# EAGLE design ESP Nano (EAGLE 6.5.0)
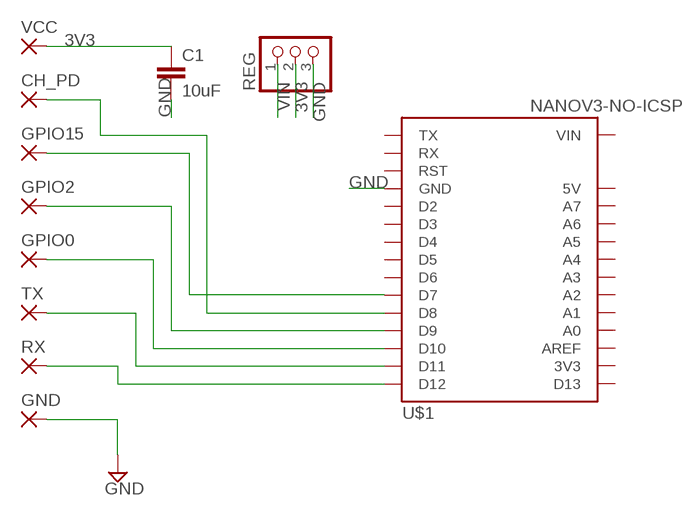
[diagram p0: schematic, sheet 1]

## Parts
C1  10uF  C2,5-3  [C2.5-3]
CH_PD  1,6/0,9  [1,6/0,9]
GND  1,6/0,9  [1,6/0,9]
GPIO0  1,6/0,9  [1,6/0,9]
GPIO2  1,6/0,9  [1,6/0,9]
GPIO15  1,6/0,9  [1,6/0,9]
REG  PINHD-1X3  [1X03]
RX  1,6/0,9  [1,6/0,9]
TX  1,6/0,9  [1,6/0,9]
U$1  NANOV3-NO-ICSP  [NANOV3-NO-ICSP]
VCC  1,6/0,9  [1,6/0,9]

## Nets
3V3: C1.1 REG.2 VCC.1(P)
GND: C1.2 GND.1(P) REG.3 U$1.GND@1(GND) U$1.GND@2(GND)
N$1: RX.1(P) U$1.D12
N$3: GPIO0.1(P) U$1.D10
N$4: GPIO2.1(P) U$1.D9
N$5: TX.1(P) U$1.D11
N$6: GPIO15.1(P) U$1.D7
N$10: CH_PD.1(P) U$1.D8
VIN: REG.1
Unconnected: U$1.3V3 U$1.5V U$1.A0 U$1.A1 U$1.A2 U$1.A3 U$1.A4 U$1.A5 U$1.A6 U$1.A7 U$1.AREF U$1.D2 U$1.D3 U$1.D4 U$1.D5 U$1.D6 U$1.D13 U$1.RST1(RST) U$1.RST2(RST) U$1.RX U$1.TX

## Power pins joined to a net without a drawn wire
VIN: U$1.VIN

## Library data of the parts
C1 = capacitor-wima:C: CAPACITOR naming: grid - package width
CH_PD GND GPIO0 GPIO2 GPIO15 RX TX VCC = wirepad:1,6/0,9: THROUGH-HOLE PAD
REG = pinhead:PINHD-1X3: PIN HEADER
U$1 = Franc:NANOV3-NO-ICSP: Nano V3 without the ICSP header

## Board
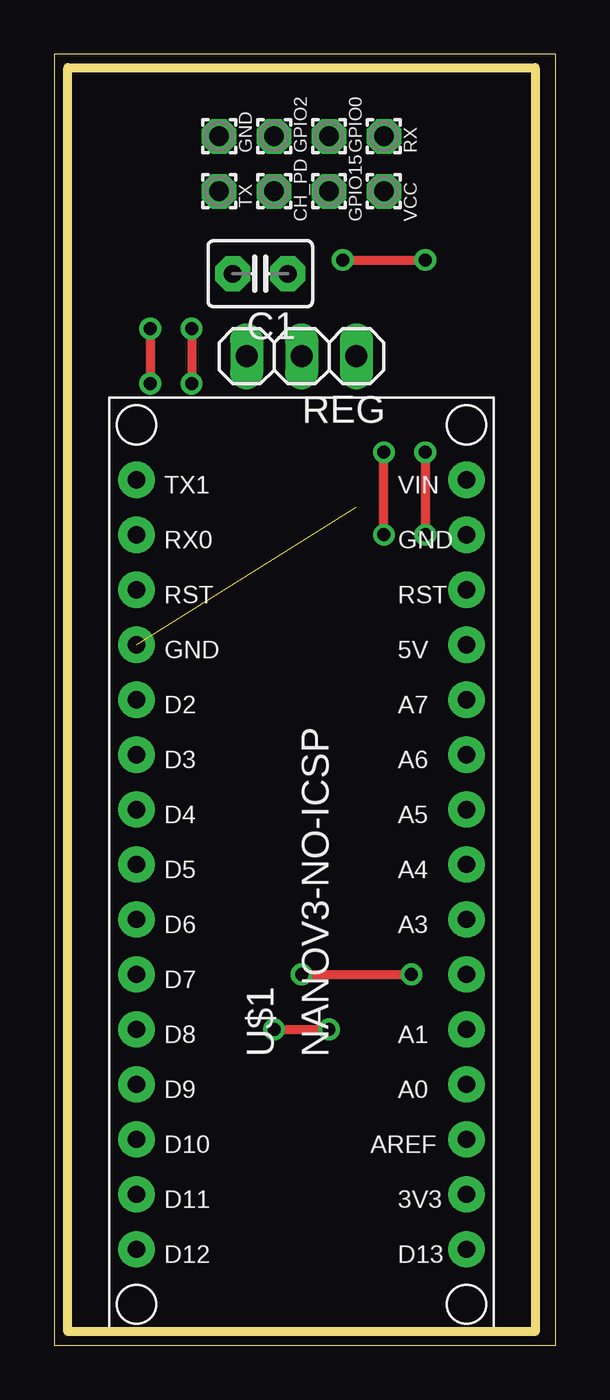
[diagram p1: board, top side]
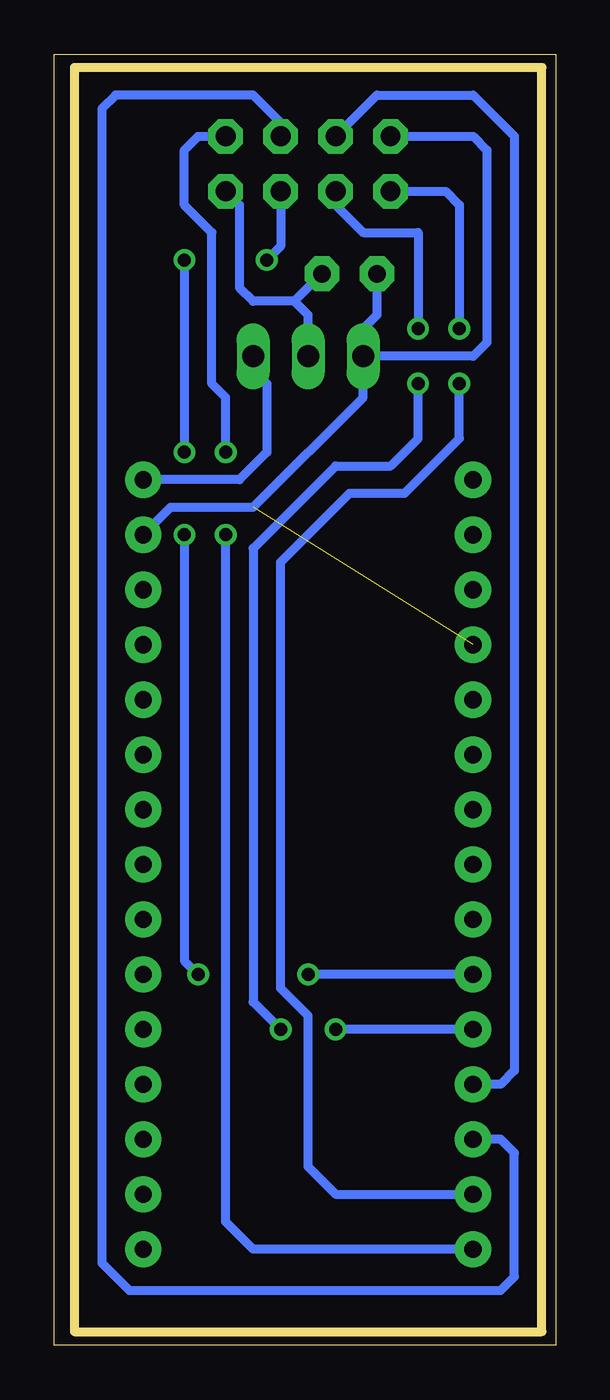
[diagram p2: board, bottom side, seen from below]

Size 23.16 x 59.68 mm. Coordinates in mm from the lower left corner, seen from the top.
Outline: 0,0 23.16,0 23.16,59.68 0,59.68 0,0
Copper layers (1*16): Top 0.035mm / dielectric 1.5mm / Bottom 0.035mm
Design rules "default": minimum track width 10mil, minimum drill 24mil, track to track 8mil, track to pad 8mil, pad to pad 8mil, via to via 8mil, smd to smd 8mil, copper to edge 40mil, drill to drill 8mil, minimum pad ring 10mil, minimum via ring 8mil, stop-mask expansion 4mil, vias tented up to drill 0mil, thermal gap 10mil
Milling: 4 lines

### Footprints (pad centres in the part's own frame; a part is rotated, then mirrored left to right if it is on the bottom)
C2.5-3 = drill 0.813 pad 1.6 octagon: 1 -1.27,0; 2 1.27,0
1,6/0,9 = drill 0.914 pad 1.6 octagon: 1 0,0
1X03 = drill 1.016 long: 1 -2.54,0; 2 0,0; 3 2.54,0
NANOV3-NO-ICSP = drill 0.8 pad 1.676: 3V3 3.81,-13.97; 5V 3.81,11.43; A0 3.81,-8.89; A1 3.81,-6.35; A2 3.81,-3.81; A3 3.81,-1.27; A4 3.81,1.27; A5 3.81,3.81; A6 3.81,6.35; A7 3.81,8.89; AREF 3.81,-11.43; D2 -11.43,8.89; D3 -11.43,6.35; D4 -11.43,3.81; D5 -11.43,1.27; D6 -11.43,-1.27; D7 -11.43,-3.81; D8 -11.43,-6.35; D9 -11.43,-8.89; D10 -11.43,-11.43; D11 -11.43,-13.97; D12 -11.43,-16.51; D13 3.81,-16.51; GND@1 -11.43,11.43; GND@2 3.81,16.51; RST1 -11.43,13.97; RST2 3.81,13.97; RX -11.43,16.51; TX -11.43,19.05; VIN 3.81,19.05

### Placement (x,y rotation side)
C1  9.53,49.53 180 top
CH_PD  10.16,53.34 90 top
GND  7.62,55.88 90 top
GPIO0  12.7,55.88 90 top
GPIO2  10.16,55.88 90 top
GPIO15  12.7,53.34 90 top
REG  11.43,45.72 180 top
RX  15.24,55.88 90 top
TX  7.62,53.34 90 top
U$1  15.24,20.95 0 top
VCC  15.24,53.34 90 top

### Tracks (layer width: path | path; a pad name or v marks a point on that pad's centre or on a via)
3V3
  Bottom 0.406: REG.2 11.43,47.62 12.06,48.26 | 12.06,48.26 13.97,48.26 14.61,48.9 14.61,52.7 VCC.1 | C1.1 12.06,48.26
GND  (1 unrouted)
  Bottom 0.406: REG.3 3.81,45.72 3.17,46.35 3.17,55.24 3.81,55.88 GND.1 | REG.3 8.89,43.81 13.97,38.73 17.78,38.73 U$1.GND@2 | C1.2 8.26,47.62 8.89,46.99 REG.3
N$1  (via drill 0.6)
  Top 0.406: v15.24,37.47 v15.24,41.27
  Bottom 0.406: U$1.D12 13.97,4.45 15.24,5.71 v15.24,37.47 | RX.1 16.51,55.88 17.14,55.24 17.14,52.7 15.88,51.44 15.88,44.45 15.24,43.81 v15.24,41.27
N$3
  Bottom 0.406: GPIO0.1 12.7,56.52 13.97,57.78 20.32,57.78 20.95,57.15 20.95,3.81 19.68,2.54 2.54,2.54 1.91,3.17 1.91,8.89 2.54,9.53 U$1.D10
N$4
  Bottom 0.406: GPIO2.1 8.26,57.78 3.81,57.78 1.91,55.88 1.91,12.7 2.54,12.06 U$1.D9
N$5  (via drill 0.6)
  Top 0.406: v4.45,46.99 v4.45,44.45
  Bottom 0.406: v4.45,44.45 4.45,41.91 6.99,39.37 9.53,39.37 12.7,36.2 12.7,16.51 11.43,15.24 11.43,8.26 10.16,6.99 U$1.D11 | TX.1 5.08,53.34 4.45,52.7 v4.45,46.99
N$6  (via drill 0.6)
  Top 0.406: v13.34,50.16 v17.14,50.16 | v17.14,41.27 v17.14,37.47 | v11.43,17.14 v16.51,17.14
  Bottom 0.406: GPIO15.1 12.7,50.8 v13.34,50.16 | v17.14,37.47 17.14,17.78 v16.51,17.14 | U$1.D7 v11.43,17.14 | v17.14,50.16 v17.14,41.27
N$10  (via drill 0.6)
  Top 0.406: v6.35,46.99 v6.35,44.45 | v10.16,14.61 v12.7,14.61
  Bottom 0.406: v12.7,14.61 13.97,15.88 13.97,36.83 10.16,40.64 7.62,40.64 6.35,41.91 v6.35,44.45 | U$1.D8 v10.16,14.61 | CH_PD.1 10.16,52.7 8.89,51.44 6.35,51.44 v6.35,46.99
VIN
  Bottom 0.406: REG.1 13.97,45.09 13.34,44.45 13.34,41.27 14.61,40.01 U$1.VIN